# Altium schematic sheet Sheet3.SchDoc
size A4; SheetNumber: 2; SheetTotal: 2
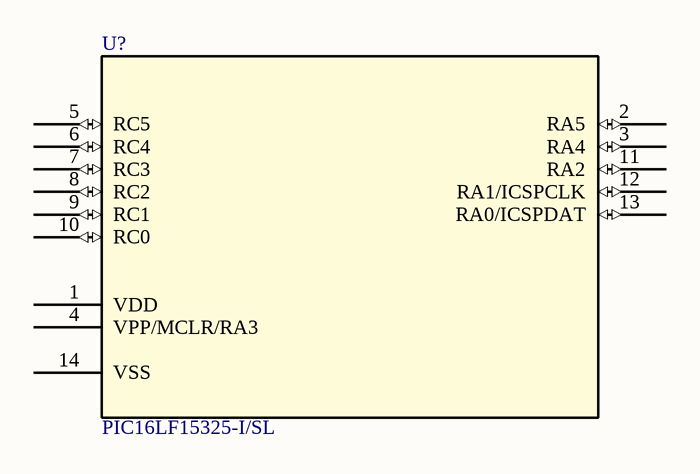
[diagram p0: Sheet3.SchDoc]

## Parts
U?  PIC16LF15325-I/SL  [SOIC14_SL_MCH]

## Nets

Not connected (* = marked no-connect by the designer): U? 1(VDD) 2(RA5) 3(RA4) 4(VPP/MCLR/RA3) 5(RC5) 6(RC4) 7(RC3) 8(RC2) 9(RC1) 10(RC0) 11(RA2) 12(RA1/ICSPCLK) 13(RA0/ICSPDAT) 14(VSS)

## Library data of the parts
U? = PIC16LF15325-I/SL: No Description Available; SourceLibrary: Microchip_2020-03-04; Built_By: EMA_Cory; Vendor: Microchip; Datasheet: http://ww1.microchip.com/downloads/en/DeviceDoc/PIC16-L-F15325-45-Data-Sheet-40001865D.pdf; Copyright: Copyright (C) 2018 Accelerated Designs. All rights reserved; Manufacturer_Part_Number: PIC16LF15325-I/SL; RefDes: RefDes; Type: DEV